# EAGLE schematic ORESAT_CAMERA_BOARD_V0 (EAGLE 9.0.0)
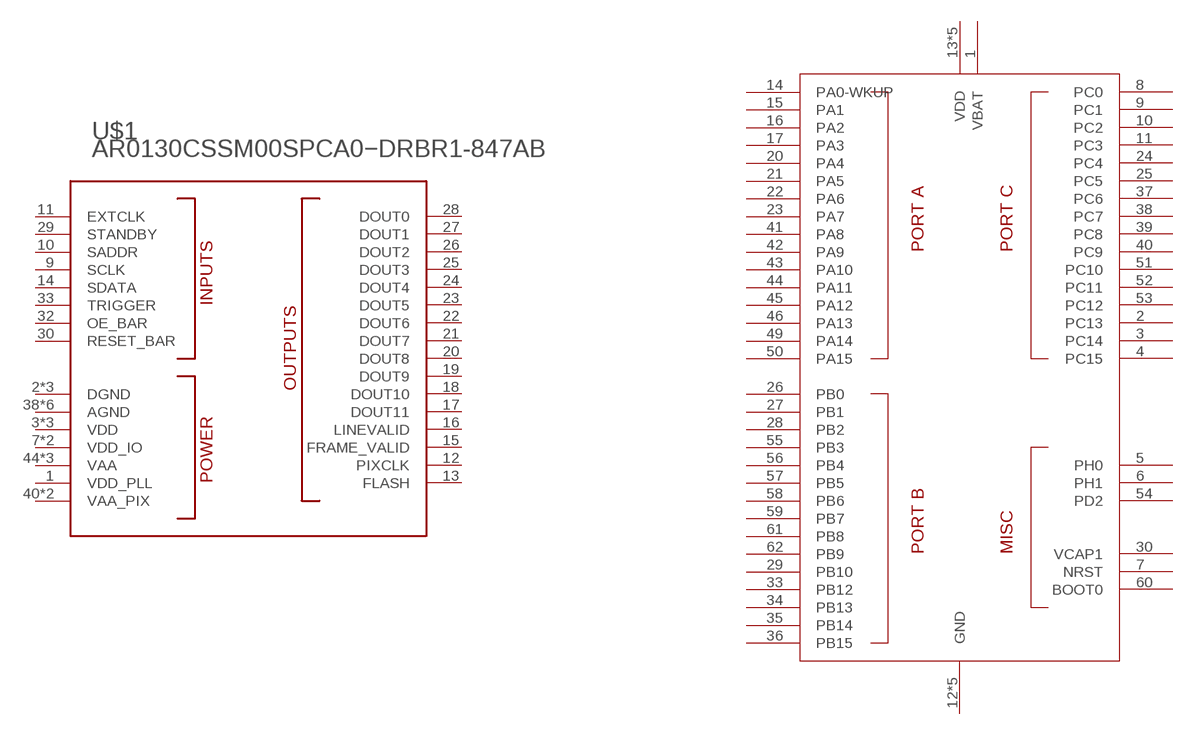
[diagram p0: schematic, sheet 1]

## Parts
U$1  AR0130CSSM00SPCA0−DRBR1-847AB  [AR0130CSSM00SPCA0−DRBR1-847AB]
U$2  STM32F446  [LQFP64]
Unconnected: U$1.1(VDD_PLL) U$1.2(DGND) U$1.3(VDD) U$1.4(VDD) U$1.5(DGND) U$1.6(DGND) U$1.7(VDD_IO) U$1.8(VDD_IO) U$1.9(SCLK) U$1.10(SADDR) U$1.11(EXTCLK) U$1.12(PIXCLK) U$1.13(FLASH) U$1.14(SDATA) U$1.15(FRAME_VALID) U$1.16(LINEVALID) U$1.17(DOUT11) U$1.18(DOUT10) U$1.19(DOUT9) U$1.20(DOUT8) U$1.21(DOUT7) U$1.22(DOUT6) U$1.23(DOUT5) U$1.24(DOUT4) U$1.25(DOUT3) U$1.26(DOUT2) U$1.27(DOUT1) U$1.28(DOUT0) U$1.29(STANDBY) U$1.30(RESET_BAR) U$1.32(OE_BAR) U$1.33(TRIGGER) U$1.34(VDD) U$1.38(AGND) U$1.39(AGND) U$1.40(VAA_PIX) U$1.41(VAA_PIX) U$1.42(AGND) U$1.43(AGND) U$1.44(VAA) U$1.45(VAA) U$1.46(VAA) U$1.47(AGND) U$1.48(AGND) U$2.1(VBAT) U$2.2(PC13) U$2.3(PC14) U$2.4(PC15) U$2.5(PH0) U$2.6(PH1) U$2.7(NRST) U$2.8(PC0) U$2.9(PC1) U$2.10(PC2) U$2.11(PC3) U$2.12(GND) U$2.13(VDD) U$2.14(PA0-WKUP) U$2.15(PA1) U$2.16(PA2) U$2.17(PA3) U$2.18(GND) U$2.19(VDD) U$2.20(PA4) U$2.21(PA5) U$2.22(PA6) U$2.23(PA7) U$2.24(PC4) U$2.25(PC5) U$2.26(PB0) U$2.27(PB1) U$2.28(PB2) U$2.29(PB10) U$2.30(VCAP1) U$2.31(GND) U$2.32(VDD) U$2.33(PB12) U$2.34(PB13) U$2.35(PB14) U$2.36(PB15) U$2.37(PC6) U$2.38(PC7) U$2.39(PC8) U$2.40(PC9) U$2.41(PA8) U$2.42(PA9) U$2.43(PA10) U$2.44(PA11) U$2.45(PA12) U$2.46(PA13) U$2.47(GND) U$2.48(VDD) U$2.49(PA14) U$2.50(PA15) U$2.51(PC10) U$2.52(PC11) U$2.53(PC12) U$2.54(PD2) U$2.55(PB3) U$2.56(PB4) U$2.57(PB5) U$2.58(PB6) U$2.59(PB7) U$2.60(BOOT0) U$2.61(PB8) U$2.62(PB9) U$2.63(GND) U$2.64(VDD)

## Library data of the parts
U$1 = Oliver_Custom:AR0130CSSM00SPCA0−DRBR1-847AB
U$2 = Oliver_Custom:STM32F446: 64-pin STM32F4 chip with symbol for Foxcar Control Board v1.